# EAGLE design enhanced-dual-joystick (EAGLE 7.7.0)
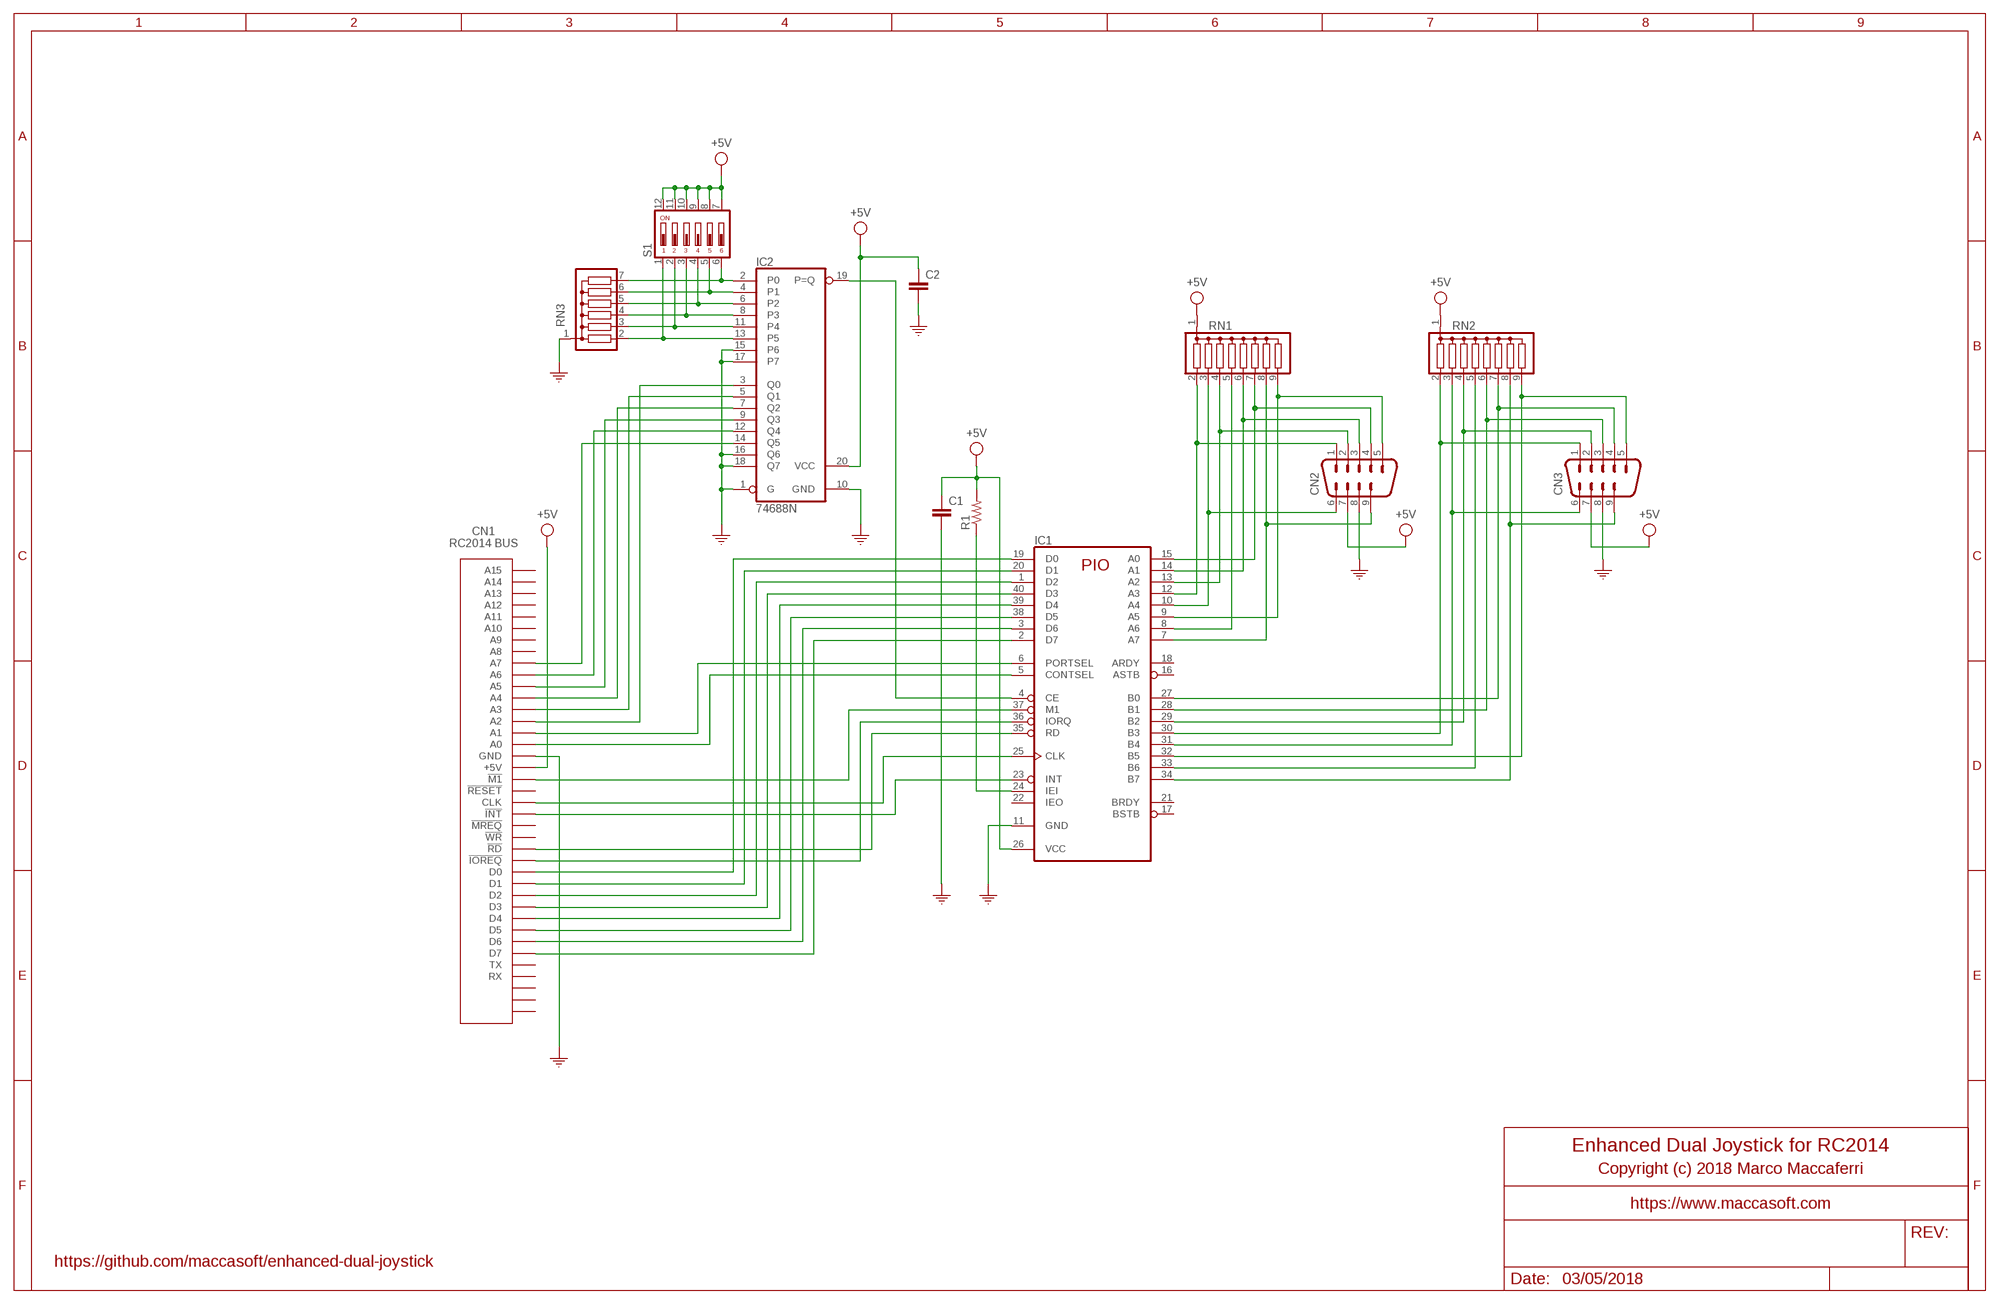
[diagram p0: schematic, sheet 1]

## Parts
C1  C-EU050-025X075  [C050-025X075]
C2  C-EU050-025X075  [C050-025X075]
CN1  RC2014BUS  [RC2014BUS]
CN2  M09H  [M09H]
CN3  M09H  [M09H]
IC1  Z80PIO  [DIL40]
IC2  74688N  [DIL20]
R1  R-US_0207/10  [0207/10]
RN1  G08R  [SIL9]
RN2  G08R  [SIL9]
RN3  G06R  [SIL7]
S1  DIP06YL  [DIP06YL]

## Nets
+5V: C1.1 C2.1 CN1.+5V CN2.7 CN3.7 IC1.26(VCC) IC2.20(VCC) R1.2 RN1.1 RN2.1 S1.7 S1.8 S1.9 S1.10 S1.11 S1.12
GND: C1.2 C2.2 CN1.GND CN2.8 CN3.8 IC1.11(GND) IC2.1(G) IC2.10(GND) IC2.15(P6) IC2.16(Q6) IC2.17(P7) IC2.18(Q7) RN3.1
N$1: CN2.1 IC1.12(A3) RN1.2
N$2: CN2.6 IC1.10(A4) RN1.3
N$3: CN2.2 IC1.13(A2) RN1.4
N$4: IC1.8(A6) RN1.5
N$5: CN2.3 IC1.14(A1) RN1.6
N$6: CN2.4 IC1.15(A0) RN1.7
N$7: CN2.9 IC1.7(A7) RN1.8
N$8: CN2.5 IC1.9(A5) RN1.9
N$9: IC2.2(P0) RN3.7 S1.6
N$10: IC2.4(P1) RN3.6 S1.5
N$11: IC2.6(P2) RN3.5 S1.4
N$12: IC2.8(P3) RN3.4 S1.3
N$13: IC2.11(P4) RN3.3 S1.2
N$14: IC2.13(P5) RN3.2 S1.1
N$15: CN1.A7 IC2.14(Q5)
N$16: CN1.A6 IC2.12(Q4)
N$17: CN1.D7 IC1.2(D7)
N$18: CN1.D6 IC1.3(D6)
N$19: CN1.D5 IC1.38(D5)
N$20: CN1.D4 IC1.39(D4)
N$21: CN1.D3 IC1.40(D3)
N$22: CN1.D2 IC1.1(D2)
N$23: CN1.D1 IC1.20(D1)
N$24: CN1.D0 IC1.19(D0)
N$25: CN1.!IOREQ! IC1.36(IORQ)
N$26: CN1.!RD! IC1.35(RD)
N$27: CN1.!M1! IC1.37(M1)
N$28: CN1.CLK IC1.25(CLK)
N$29: CN1.!INT! IC1.23(INT)
N$30: CN1.A5 IC2.9(Q3)
N$31: CN1.A4 IC2.7(Q2)
N$32: CN1.A3 IC2.5(Q1)
N$33: CN1.A2 IC2.3(Q0)
N$34: IC1.4(CE) IC2.19(P=Q)
N$37: CN1.A1 IC1.6(PORTSEL)
N$38: CN1.A0 IC1.5(CONTSEL)
N$39: IC1.33(B6) RN2.5
N$40: IC1.24(IEI) R1.1
N$41: CN3.1 IC1.30(B3) RN2.2
N$42: CN3.6 IC1.31(B4) RN2.3
N$43: CN3.2 IC1.29(B2) RN2.4
N$44: CN3.3 IC1.28(B1) RN2.6
N$45: CN3.4 IC1.27(B0) RN2.7
N$46: CN3.9 IC1.34(B7) RN2.8
N$47: CN3.5 IC1.32(B5) RN2.9
Unconnected: CN1.!MREQ! CN1.!RESET! CN1.!WR! CN1.A8 CN1.A9 CN1.A10 CN1.A11 CN1.A12 CN1.A13 CN1.A14 CN1.A15 CN1.RX CN1.SPARE1 CN1.SPARE2 CN1.SPARE3 CN1.TX IC1.16(ASTB) IC1.17(BSTB) IC1.18(ARDY) IC1.21(BRDY) IC1.22(IEO)

## Notes on the sheet
- CN1
  RC2014 BUS
- Enhanced Dual Joystick for RC2014
- Copyright (c) 2018 Marco Maccaferri
- https://www.maccasoft.com
- https://github.com/maccasoft/enhanced-dual-joystick
- 03/05/2018

## Library data of the parts
C1 C2 = rc2014-joystick:C-EU: CAPACITOR, European symbol
CN1 = rc2014-joystick:RC2014BUS; MPN: PRPC040SBAN-M71RC
CN2 CN3 = rc2014-joystick:M09: SUB-D; OC_FARNELL: unknown; OC_NEWARK: unknown
IC1 = rc2014-joystick:Z80PIO: Z80 FAMILY DEVICE
IC2 = rc2014-joystick:74*688: 8-bit MAGNITUDE/IDENTITY COMPARATOR, totem pole
R1 = rc2014-joystick:R-US_: RESISTOR, American symbol
RN1 RN2 = rc2014-joystick:G08R: SIL RESISTOR; OC_FARNELL: unknown; OC_NEWARK: unknown
RN3 = rc2014-joystick:G06R: SIL RESISTOR; OC_FARNELL: unknown; OC_NEWARK: unknown
S1 = rc2014-joystick:DIP06YL: DIL/CODE SWITCH; OC_FARNELL: unknown; OC_NEWARK: unknown

## Board
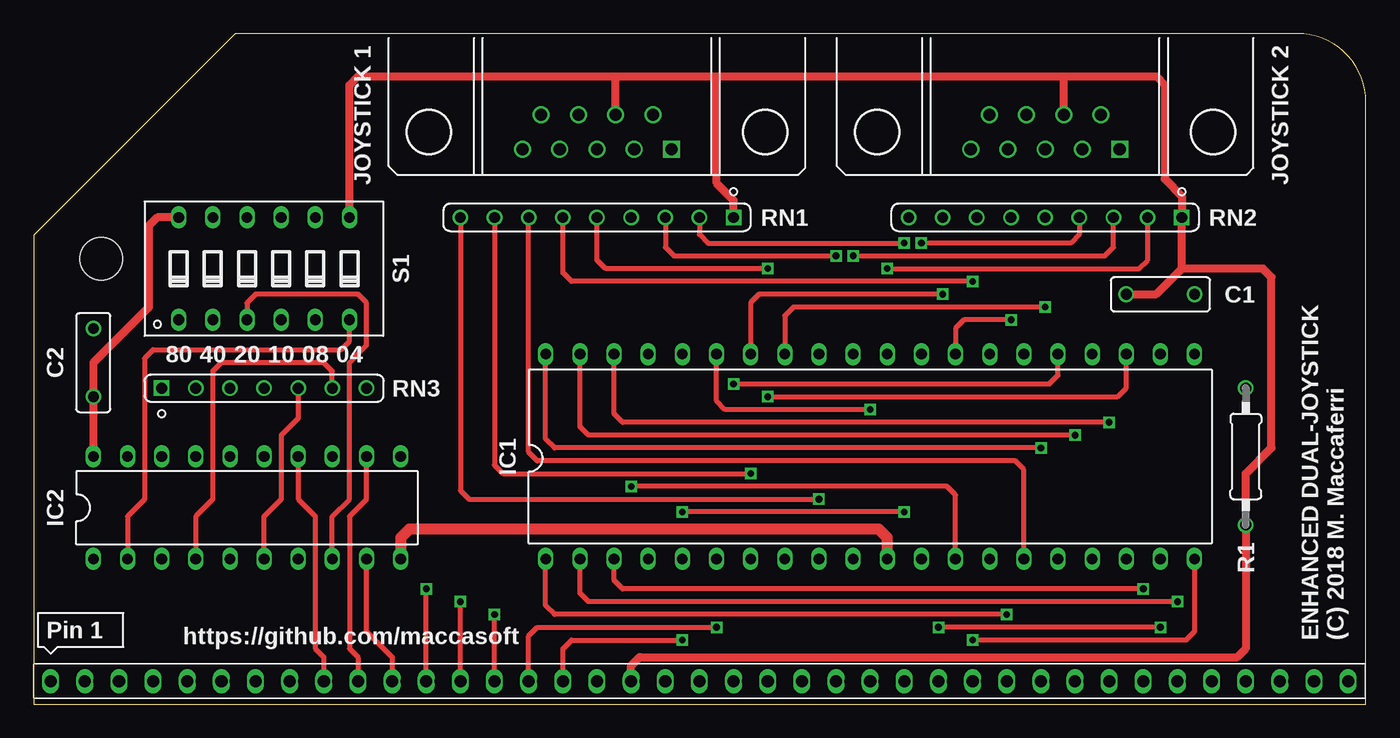
[diagram p1: board, top side]
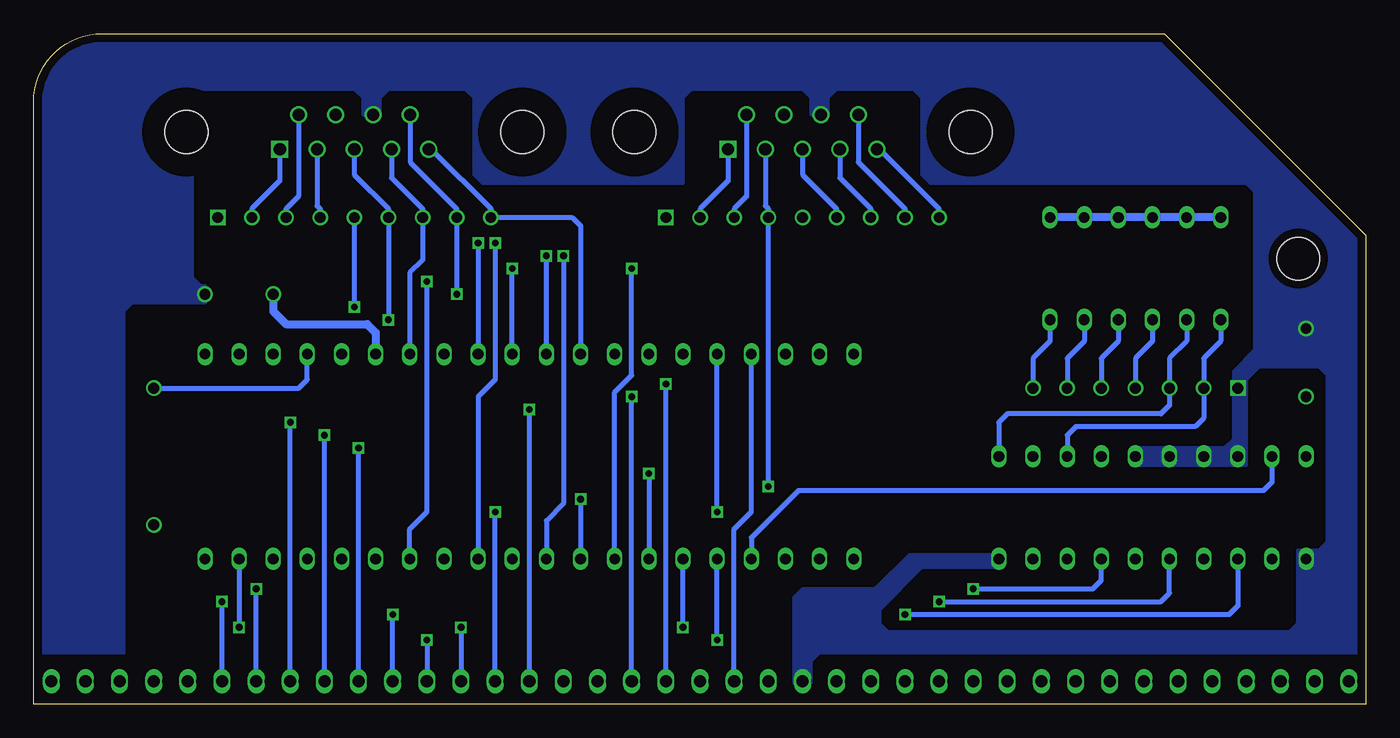
[diagram p2: board, bottom side, seen from below]

Size 99.11 x 49.86 mm. Coordinates in mm from the lower left corner, seen from the top.
Outline: 0,0 99.11,0 99.11,44.76 arc90 94.01,49.86 15.01,49.86 0,34.85 0,0
Copper layers (1*16): Top 0.0356mm / dielectric 1.5011mm / Bottom 0.0356mm
Design rules "maccasoft": minimum track width 6mil, minimum drill 13mil, track to track 6mil, track to pad 6mil, pad to pad 6mil, via to via 6mil, smd to smd 6mil, copper to edge 15mil, drill to drill 6mil, minimum pad ring 7mil, minimum via ring 7mil, stop-mask expansion 7mil, vias tented up to drill 0.5mm, thermal gap 10mil
Holes 3.2 mm at 5.03,33.12

### Footprints (pad centres in the part's own frame; a part is rotated, then mirrored left to right if it is on the bottom)
C050-025X075 = drill 0.8: 1 -2.54,0; 2 2.54,0
RC2014BUS = drill 0.9 long: !INT! 0,-5.08; !IOREQ! 0,-15.24; !M1! 0,2.54; !MREQ! 0,-7.62; !RD! 0,-12.7; !RESET! 0,0; !WR! 0,-10.16; +5V 0,5.08; A0 0,10.16; A1 0,12.7; A2 0,15.24; A3 0,17.78; A4 0,20.32; A5 0,22.86; A6 0,25.4; A7 0,27.94; A8 0,30.48; A9 0,33.02; A10 0,35.56; A11 0,38.1; A12 0,40.64; A13 0,43.18; A14 0,45.72; A15 0,48.26; CLK 0,-2.54; D0 0,-17.78; D1 0,-20.32; D2 0,-22.86; D3 0,-25.4; D4 0,-27.94; D5 0,-30.48; D6 0,-33.02; D7 0,-35.56; GND 0,7.62; RX 0,-40.64; SPARE1 0,-43.18; SPARE2 0,-45.72; SPARE3 0,-48.26; TX 0,-38.1
M09H = drill 0.9 square: 1 -5.54,1.27 | drill 0.9: 2 -2.77,1.27; 3 0,1.27; 4 2.77,1.27; 5 5.54,1.27; 6 -4.155,-1.27; 7 -1.385,-1.27; 8 1.385,-1.27; 9 4.155,-1.27 | hole 3.2: -12.5,0; 12.5,0
DIL40 = drill 0.8 long: 1 -24.13,-7.62; 2 -21.59,-7.62; 3 -19.05,-7.62; 4 -16.51,-7.62; 5 -13.97,-7.62; 6 -11.43,-7.62; 7 -8.89,-7.62; 8 -6.35,-7.62; 9 -3.81,-7.62; 10 -1.27,-7.62; 11 1.27,-7.62; 12 3.81,-7.62; 13 6.35,-7.62; 14 8.89,-7.62; 15 11.43,-7.62; 16 13.97,-7.62; 17 16.51,-7.62; 18 19.05,-7.62; 19 21.59,-7.62; 20 24.13,-7.62; 21 24.13,7.62; 22 21.59,7.62; 23 19.05,7.62; 24 16.51,7.62; 25 13.97,7.62; 26 11.43,7.62; 27 8.89,7.62; 28 6.35,7.62; 29 3.81,7.62; 30 1.27,7.62; 31 -1.27,7.62; 32 -3.81,7.62; 33 -6.35,7.62; 34 -8.89,7.62; 35 -11.43,7.62; 36 -13.97,7.62; 37 -16.51,7.62; 38 -19.05,7.62; 39 -21.59,7.62; 40 -24.13,7.62
DIL20 = drill 0.8 long: 1 -11.43,-3.81; 2 -8.89,-3.81; 3 -6.35,-3.81; 4 -3.81,-3.81; 5 -1.27,-3.81; 6 1.27,-3.81; 7 3.81,-3.81; 8 6.35,-3.81; 9 8.89,-3.81; 10 11.43,-3.81; 11 11.43,3.81; 12 8.89,3.81; 13 6.35,3.81; 14 3.81,3.81; 15 1.27,3.81; 16 -1.27,3.81; 17 -3.81,3.81; 18 -6.35,3.81; 19 -8.89,3.81; 20 -11.43,3.81
0207/10 = drill 0.8: 1 -5.08,0; 2 5.08,0
SIL9 = drill 0.8 square: 1 -10.16,0 | drill 0.8: 2 -7.62,0; 3 -5.08,0; 4 -2.54,0; 5 0,0; 6 2.54,0; 7 5.08,0; 8 7.62,0; 9 10.16,0
SIL7 = drill 0.8 square: 1 -7.62,0 | drill 0.8: 2 -5.08,0; 3 -2.54,0; 4 0,0; 5 2.54,0; 6 5.08,0; 7 7.62,0
DIP06YL = drill 0.8 long: 1 -6.35,-3.81; 2 -3.81,-3.81; 3 -1.27,-3.81; 4 1.27,-3.81; 5 3.81,-3.81; 6 6.35,-3.81; 7 6.35,3.81; 8 3.81,3.81; 9 1.27,3.81; 10 -1.27,3.81; 11 -3.81,3.81; 12 -6.35,3.81

### Placement (x,y rotation side)
C1  83.82,30.48 0 top
C2  4.45,25.4 90 top
CN1  49.53,1.72 90 top
CN2  41.91,42.55 180 top
CN3  75.25,42.55 180 top
IC1  62.23,18.41 0 top
IC2  15.88,14.61 0 top
R1  90.17,18.41 270 top
RN1  41.91,36.2 180 top
RN2  75.25,36.2 180 top
RN3  17.14,23.5 0 top
S1  17.14,32.38 0 top

### Tracks (layer width: path | path; a pad name or v marks a point on that pad's centre or on a via)
+5V
  Top 0.61: CN1.+5V 44.45,2.86 45.09,3.49 89.53,3.49 90.17,4.13 R1.2 90.17,17.14 92.08,19.05 92.08,31.75 91.44,32.38 85.41,32.38 | S1.7 23.5,46.04 24.13,46.67 43.5,46.67 | 43.5,46.67 50.8,46.67 | 50.8,46.67 76.83,46.67 | 76.83,46.67 83.5,46.67 84.14,46.04 84.14,39.05 85.41,37.78 RN2.1 85.41,32.38 | C1.1 83.5,30.48 85.41,32.38 | RN1.1 52.07,37.47 50.8,38.73 50.8,46.67 | S1.12 9.21,36.2 8.57,35.56 8.57,29.53 4.45,25.4 C2.1 IC2.20 | CN3.7 76.63,46.47 76.83,46.67 | CN2.7 43.3,46.47 43.5,46.67
  Bottom 0.61: S1.12 S1.11 S1.10 S1.9 S1.8 S1.7 | C1.1 81.28,29.21 80.33,28.26 74.3,28.26 73.66,27.62 IC1.26
GND
  Top 0.813: IC1.11 63.5,12.38 62.87,13.02 27.94,13.02 27.3,12.38 IC2.10
  pour Bottom (isolate 0.61, no thermals): 41.27,1.59 42.55,1.59 42.55,7.94 41.91,8.57 36.51,8.57 33.97,11.11 26.99,11.11 26.99,10.16 33.02,10.16 36.2,6.99 36.2,6.03 35.56,5.4 5.71,5.4 5.08,6.03 5.08,11.43 3.49,11.43 2.86,12.06 2.86,24.45 3.49,25.08 7.94,25.08 8.89,24.13 8.89,17.78 17.46,17.78 17.46,19.05 10.48,19.05 9.84,19.68 9.84,24.77 8.26,26.35 8.26,38.1 8.89,38.73 33.02,38.73 33.02,45.09 33.66,45.72 39.37,45.72 40.01,45.09 40.01,43.81 41.27,43.81 41.27,45.09 41.91,45.72 50.16,45.72 50.8,45.09 50.8,38.73 66.36,38.73 66.36,45.09 66.99,45.72 72.71,45.72 73.34,45.09 73.34,43.81 74.61,43.81 74.61,45.09 75.25,45.72 87.31,45.72 87.31,31.75 86.68,31.11 86.36,31.11 86.36,29.84 91.76,29.84 92.39,29.21 92.39,3.81 99.06,3.81 99.06,49.85 14.92,49.85 0,34.92 0,3.81 40.64,3.81 41.27,3.17
N$1  (via drill 0.5)
  Top 0.356: RN1.2 49.53,34.92 50.16,34.29 v64.77,34.29
  Bottom 0.356: v64.77,34.29 64.77,24.13 66.04,22.86 IC1.12 | CN2.1 47.45,38.91 49.53,36.83 RN1.2
N$2  (via drill 0.5)
  Top 0.356: RN1.3 46.99,33.97 47.62,33.34 v59.69,33.34
  Bottom 0.356: v59.69,33.34 59.69,14.92 60.96,13.65 IC1.10 | CN2.6 46.06,37.76 46.99,36.83 RN1.3
N$3  (via drill 0.5)
  Top 0.356: IC1.13 68.58,15.56 67.94,16.19 v44.45,16.19
  Bottom 0.356: v44.45,16.19 RN1.4 44.45,36.83 44.68,37.06 CN2.2
N$4  (via drill 0.5)
  Top 0.356: v54.61,32.38 42.55,32.38 41.91,33.02 RN1.5
  Bottom 0.356: IC1.8 55.88,23.18 54.61,24.45 v54.61,32.38
N$5  (via drill 0.5)
  Top 0.356: v69.85,31.43 40.01,31.43 39.37,32.07 RN1.6
  Bottom 0.356: IC1.14 71.12,13.02 69.85,14.29 v69.85,31.43 | CN2.3 41.91,39.37 39.37,36.83 RN1.6
N$6
  Top 0.356: IC1.15 73.66,17.46 73.03,18.1 37.47,18.1 36.83,18.73 RN1.7
  Bottom 0.356: CN2.4 39.14,39.14 36.83,36.83 RN1.7
N$7  (via drill 0.5)
  Top 0.356: RN1.8 34.29,17.78 34.92,17.14 v53.34,17.14
  Bottom 0.356: v53.34,17.14 IC1.7 | CN2.9 37.76,40.3 34.29,36.83 RN1.8
N$8  (via drill 0.5)
  Top 0.356: RN1.9 31.75,15.88 32.38,15.24 v58.42,15.24
  Bottom 0.356: v58.42,15.24 IC1.9 | CN2.5 36.2,41.27 31.75,36.83 RN1.9
N$9
  Top 0.356: IC2.2 6.99,13.97 8.26,15.24 8.26,25.72 8.89,26.35 22.86,26.35 23.5,26.99 S1.6
  Bottom 0.356: S1.6 23.5,26.99 24.77,25.72 RN3.7
N$10
  Top 0.356: RN3.6 22.23,24.77 21.59,25.4 13.97,25.4 13.34,24.77 13.34,15.24 12.06,13.97 IC2.4
  Bottom 0.356: S1.5 20.95,26.99 22.23,25.72 RN3.6
N$11
  Top 0.356: RN3.5 19.68,21.27 18.41,20 18.41,15.24 17.14,13.97 IC2.6
  Bottom 0.356: S1.4 18.41,26.99 19.68,25.72 RN3.5
N$12
  Top 0.356: IC2.8 22.23,13.97 23.5,15.24 23.5,25.4 24.77,26.67 24.77,29.84 24.13,30.48 16.51,30.48 15.88,29.84 S1.3
  Bottom 0.356: S1.3 15.88,26.99 17.14,25.72 RN3.4
N$13
  Bottom 0.356: S1.2 13.34,26.99 14.61,25.72 RN3.3 14.61,22.23 15.24,21.59 26.67,21.59 27.3,20.95 IC2.11
N$14
  Bottom 0.356: S1.1 10.79,26.99 12.06,25.72 RN3.2 12.06,21.27 12.7,20.64 21.59,20.64 22.23,20 IC2.13
N$15
  Top 0.356: CN1.A7 21.59,3.49 20.95,4.13 20.95,13.97 19.68,15.24 IC2.14
N$16
  Top 0.356: CN1.A6 24.13,3.49 23.5,4.13 23.5,13.97 24.77,15.24 IC2.12
N$17  (via drill 0.5)
  Top 0.356: v85.09,7.62 41.27,7.62 40.64,8.26 IC1.2
  Bottom 0.356: CN1.D7 v85.09,7.62
N$18  (via drill 0.5)
  Top 0.356: v82.55,8.57 43.81,8.57 43.18,9.21 IC1.3
  Bottom 0.356: CN1.D6 v82.55,8.57
N$19  (via drill 0.5)
  Top 0.356: v80.01,20.95 43.81,20.95 43.18,21.59 IC1.38
  Bottom 0.356: CN1.D5 v80.01,20.95
N$20  (via drill 0.5)
  Top 0.356: v77.47,20 41.27,20 40.64,20.64 IC1.39
  Bottom 0.356: CN1.D4 v77.47,20
N$21  (via drill 0.5)
  Top 0.356: v74.93,19.05 38.73,19.05 38.1,19.68 IC1.40
  Bottom 0.356: CN1.D3 v74.93,19.05
N$22  (via drill 0.5)
  Top 0.356: v72.39,6.67 38.73,6.67 38.1,7.3 IC1.1
  Bottom 0.356: CN1.D2 v72.39,6.67
N$23  (via drill 0.5)
  Top 0.356: IC1.20 86.36,5.4 85.72,4.76 v69.85,4.76
  Bottom 0.356: v69.85,4.76 CN1.D1
N$24  (via drill 0.5)
  Top 0.356: v83.82,5.71 v67.31,5.71
  Bottom 0.356: IC1.19 v83.82,5.71 | v67.31,5.71 CN1.D0
N$25  (via drill 0.5)
  Top 0.356: v64.77,14.29 v48.26,14.29
  Bottom 0.356: CN1.!IOREQ! v64.77,14.29 | v48.26,14.29 IC1.36
N$26  (via drill 0.5)
  Top 0.356: v62.23,21.91 51.44,21.91 50.8,22.54 IC1.35
  Bottom 0.356: CN1.!RD! v62.23,21.91
N$27
  Bottom 0.356: CN1.!M1! 46.99,13.02 45.72,14.29 IC1.37
N$28  (via drill 0.5)
  Top 0.356: v52.07,23.81 75.56,23.81 76.2,24.45 IC1.25
  Bottom 0.356: CN1.CLK v52.07,23.81
N$29  (via drill 0.5)
  Top 0.356: v54.61,22.86 80.64,22.86 81.28,23.5 IC1.23
  Bottom 0.356: CN1.!INT! v54.61,22.86
N$30
  Top 0.356: CN1.A5 26.67,3.49 24.77,5.4 IC2.9
N$31  (via drill 0.5)
  Top 0.356: CN1.A4 v29.21,8.57
  Bottom 0.356: v29.21,8.57 20.32,8.57 19.68,9.21 IC2.7
N$32  (via drill 0.5)
  Top 0.356: CN1.A3 v31.75,7.62
  Bottom 0.356: v31.75,7.62 15.24,7.62 14.61,8.26 IC2.5
N$33  (via drill 0.5)
  Top 0.356: CN1.A2 v34.29,6.67
  Bottom 0.356: v34.29,6.67 10.16,6.67 9.53,7.3 IC2.3
N$34
  Bottom 0.356: IC1.4 45.72,12.38 42.23,15.88 7.62,15.88 6.99,16.51 IC2.19
N$37  (via drill 0.5)
  Top 0.356: CN1.A1 36.83,5.08 37.47,5.71 v50.8,5.71
  Bottom 0.356: v50.8,5.71 IC1.6
N$38  (via drill 0.5)
  Top 0.356: CN1.A0 39.37,4.13 40.01,4.76 v48.26,4.76
  Bottom 0.356: v48.26,4.76 IC1.5
N$39  (via drill 0.5)
  Top 0.356: v75.25,29.53 56.52,29.53 55.88,28.89 IC1.33
  Bottom 0.356: RN2.5 v75.25,29.53
N$40
  Bottom 0.356: R1.1 79.38,23.5 78.74,24.13 IC1.24
N$41  (via drill 0.5)
  Top 0.356: v63.5,32.38 82.23,32.38 82.87,33.02 RN2.2
  Bottom 0.356: IC1.30 v63.5,32.38 | CN3.1 80.79,38.91 82.87,36.83 RN2.2
N$42  (via drill 0.5)
  Top 0.356: v60.96,33.34 79.69,33.34 80.33,33.97 RN2.3
  Bottom 0.356: IC1.31 v60.96,33.34 | CN3.6 79.4,37.76 80.33,36.83 RN2.3
N$43  (via drill 0.5)
  Top 0.356: RN2.4 77.79,34.92 77.15,34.29 v66.04,34.29
  Bottom 0.356: v66.04,34.29 IC1.29 | CN3.2 78.02,37.06 77.79,36.83 RN2.4
N$44  (via drill 0.5)
  Top 0.356: v72.71,28.57 69.22,28.57 68.58,27.94 IC1.28
  Bottom 0.356: v72.71,28.57 RN2.6 72.71,36.83 75.25,39.37 CN3.3
N$45
  Bottom 0.356: IC1.27 71.12,32.07 70.17,33.02 RN2.7 70.17,36.83 72.48,39.14 CN3.4
N$46  (via drill 0.5)
  Top 0.356: v67.63,30.48 53.98,30.48 53.34,29.84 IC1.34
  Bottom 0.356: v67.63,30.48 RN2.8 67.63,36.83 71.09,40.3 CN3.9
N$47
  Bottom 0.356: IC1.32 58.42,35.56 59.05,36.2 RN2.9 65.09,36.83 69.53,41.27 CN3.5

### Text on the board
tNames: JOYSTICK 1 | JOYSTICK 2 | 80 | 40 | 20 | 10 | 08 | 04 | https://github.com/maccasoft | ENHANCED DUAL-JOYSTICK / (C) 2018 M. Maccaferri